# EAGLE design indication_panel (EAGLE 7.3.0)
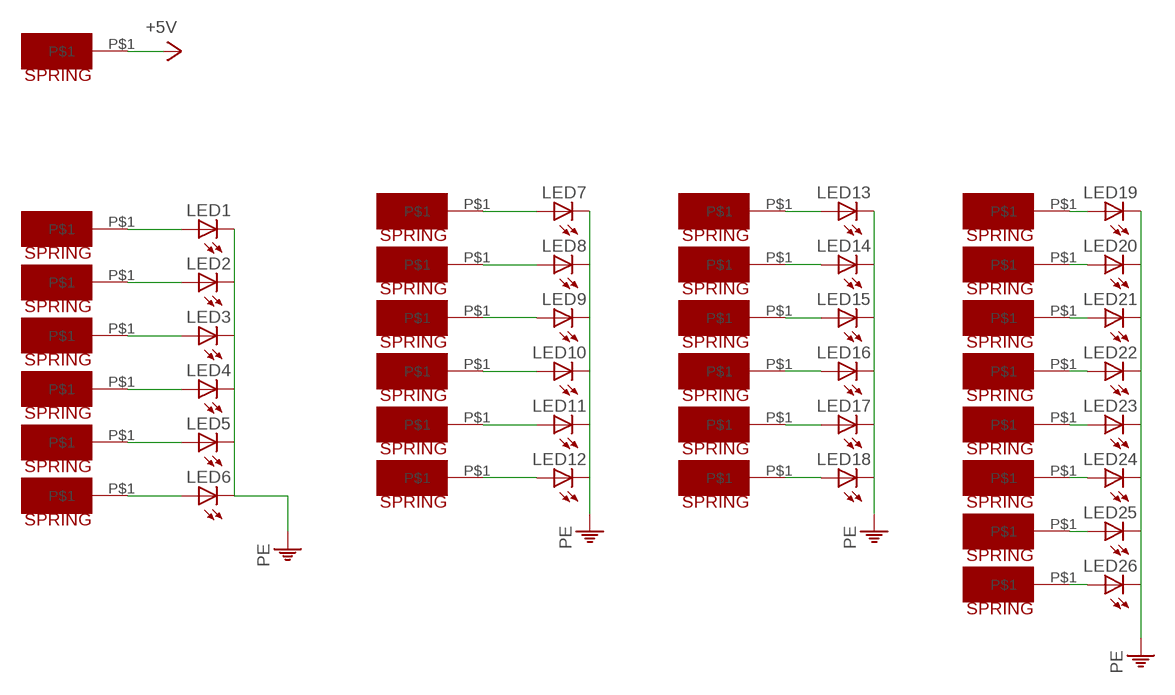
[diagram p0: schematic, sheet 1]

## Parts
+5V  SPRING  [SPRING]
LED1  LEDCHIPLED_0805  [CHIPLED_0805]
LED2  LEDCHIPLED_0805  [CHIPLED_0805]
LED3  LEDCHIPLED_0805  [CHIPLED_0805]
LED4  LEDCHIPLED_0805  [CHIPLED_0805]
LED5  LEDCHIPLED_0805  [CHIPLED_0805]
LED6  LEDCHIPLED_0805  [CHIPLED_0805]
LED7  LEDCHIPLED_0805  [CHIPLED_0805]
LED8  LEDCHIPLED_0805  [CHIPLED_0805]
LED9  LEDCHIPLED_0805  [CHIPLED_0805]
LED10  LEDCHIPLED_0805  [CHIPLED_0805]
LED11  LEDCHIPLED_0805  [CHIPLED_0805]
LED12  LEDCHIPLED_0805  [CHIPLED_0805]
LED13  LEDCHIPLED_0805  [CHIPLED_0805]
LED14  LEDCHIPLED_0805  [CHIPLED_0805]
LED15  LEDCHIPLED_0805  [CHIPLED_0805]
LED16  LEDCHIPLED_0805  [CHIPLED_0805]
LED17  LEDCHIPLED_0805  [CHIPLED_0805]
LED18  LEDCHIPLED_0805  [CHIPLED_0805]
LED19  LEDCHIPLED_0805  [CHIPLED_0805]
LED20  LEDCHIPLED_0805  [CHIPLED_0805]
LED21  LEDCHIPLED_0805  [CHIPLED_0805]
LED22  LEDCHIPLED_0805  [CHIPLED_0805]
LED23  LEDCHIPLED_0805  [CHIPLED_0805]
LED24  LEDCHIPLED_0805  [CHIPLED_0805]
LED25  LEDCHIPLED_0805  [CHIPLED_0805]
LED26  LEDCHIPLED_0805  [CHIPLED_0805]
U$1  SPRING  [SPRING]
U$2  SPRING  [SPRING]
U$3  SPRING  [SPRING]
U$4  SPRING  [SPRING]
U$6  SPRING  [SPRING]
U$7  SPRING  [SPRING]
U$8  SPRING  [SPRING]
U$9  SPRING  [SPRING]
U$10  SPRING  [SPRING]
U$11  SPRING  [SPRING]
U$12  SPRING  [SPRING]
U$13  SPRING  [SPRING]
U$14  SPRING  [SPRING]
U$15  SPRING  [SPRING]
U$16  SPRING  [SPRING]
U$17  SPRING  [SPRING]
U$18  SPRING  [SPRING]
U$19  SPRING  [SPRING]
U$20  SPRING  [SPRING]
U$21  SPRING  [SPRING]
U$22  SPRING  [SPRING]
U$23  SPRING  [SPRING]
U$24  SPRING  [SPRING]
U$25  SPRING  [SPRING]
U$26  SPRING  [SPRING]
U$27  SPRING  [SPRING]

## Nets
+5V: U$27.P$1
N$1: LED1.A U$1.P$1
N$2: LED2.A U$2.P$1
N$3: LED3.A U$3.P$1
N$4: LED4.A U$4.P$1
N$5: +5V.P$1 LED5.A
N$6: LED6.A U$6.P$1
N$7: LED7.A U$7.P$1
N$8: LED8.A U$8.P$1
N$9: LED9.A U$9.P$1
N$10: LED10.A U$10.P$1
N$11: LED11.A U$11.P$1
N$12: LED12.A U$12.P$1
N$13: LED13.A U$19.P$1
N$14: LED24.A U$18.P$1
N$15: LED14.A U$20.P$1
N$16: LED15.A U$21.P$1
N$17: LED16.A U$22.P$1
N$18: LED17.A U$23.P$1
N$19: LED18.A U$24.P$1
N$20: LED19.A U$13.P$1
N$21: LED20.A U$14.P$1
N$22: LED21.A U$15.P$1
N$23: LED22.A U$16.P$1
N$24: LED23.A U$17.P$1
N$25: LED25.A U$25.P$1
N$26: LED26.A U$26.P$1
PE: LED1.C LED2.C LED3.C LED4.C LED5.C LED6.C LED7.C LED8.C LED9.C LED10.C LED11.C LED12.C LED13.C LED14.C LED15.C LED16.C LED17.C LED18.C LED19.C LED20.C LED21.C LED22.C LED23.C LED24.C LED25.C LED26.C

## Library data of the parts
+5V U$1-U$4 U$6-U$27 = enigma:SPRING
LED1-LED26 = led:LED: LED OSRAM: - CHIPLED LG R971, LG N971, LY N971, LG Q971, LY Q971, LO R971, LY R971 LH N974, LH R974 LS Q976, LO Q976, LY Q976 LO Q996 - Hyper CHIPLED LW Q18S LB Q993, LB Q99A, LB R99A - SideLED LS A670, LO A670, LY A670, LG A670, LP A670 LB A673, LV A673, LT A673, LW A673 LH A674 LY A675 LS A676, LA A676, LO A676, LY A676, LW A676 LS A679, LY A679, LG A679 - Hyper Micro SIDELED® LS Y876, LA Y876, LO Y876, LY Y876 LT Y87S - SmartLED LW L88C, LW L88S LB L89C, LB L89S, LG L890 LS L89K, LO L89K, LY L89K LS L896, LA L896, LO L896, LY L896 - TOPLED LS T670, LO T670, LY T670, LG T670, LP T670 LSG T670, LSP T670, LSY T670, LOP T670, LYG T670 LG T671, LOG T671, LSG T671 LB T673, LV T673, LT T673, LW T673 LH T674 LS T676, LA T676, LO T676, LY T676, LB T676, LH T676, LSB T676, LW T676 LB T67C, LV T67C, LT T67C, LS T67K, LO T67K, LY T67K, LW E67C LS E67B, LA E67B, LO E67B, LY E67B, LB E67C, LV E67C, LT E67C LW T67C LS T679, LY T679, LG T679 LS T770, LO T770, LY T770, LG T770, LP T770 LB T773, LV T773, LT T773, LW T773 LH T774 LS E675, LA E675, LY E675, LS T675 LS T776, LA T776, LO T776, LY T776, LB T776 LHGB T686 LT T68C, LB T68C - Hyper Mini TOPLED® LB M676 - Mini TOPLED Santana® LG M470 LS M47K, LO M47K, LY M47K Source: http://www.osram.convergy.de LUXEON: - LUMILED® LXK2-PW12-R00, LXK2-PW12-S00, LXK2-PW14-U00, LXK2-PW14-V00 LXK2-PM12-R00, LXK2-PM12-S00, LXK2-PM14-U00 LXK2-PE12-Q00, LXK2-PE12-R00, LXK2-PE12-S00, LXK2-PE14-T00, LXK2-PE14-U00 LXK2-PB12-K00, LXK2-PB12-L00, LXK2-PB12-M00, LXK2-PB14-N00, LXK2-PB14-P00, LXK2-PB14-Q00 LXK2-PR12-L00, LXK2-PR12-M00, LXK2-PR14-Q00, LXK2-PR14-R00 LXK2-PD12-Q00, LXK2-PD12-R00, LXK2-PD12-S00 LXK2-PH12-R00, LXK2-PH12-S00 LXK2-PL12-P00, LXK2-PL12-Q00, LXK2-PL12-R00 Source: www.luxeon.com KINGBRIGHT: KA-3528ASYC Source: www.kingbright.com

## Board
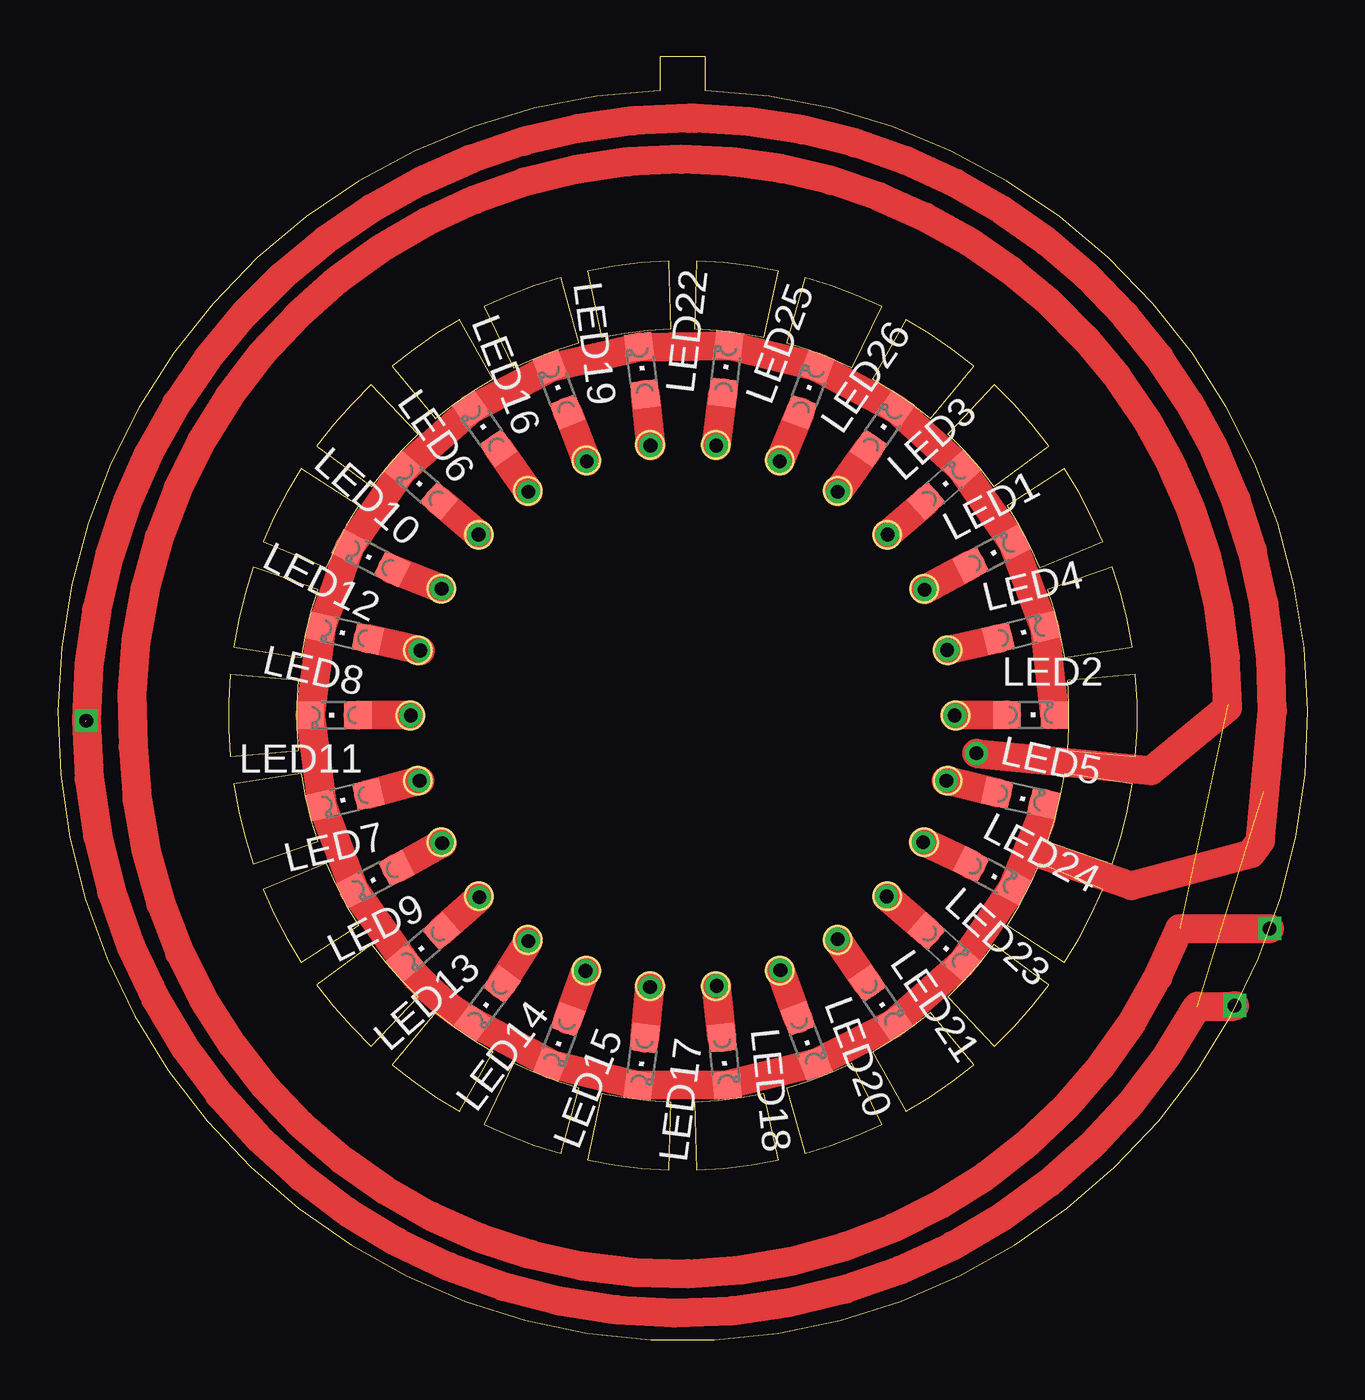
[diagram p1: board, top side]
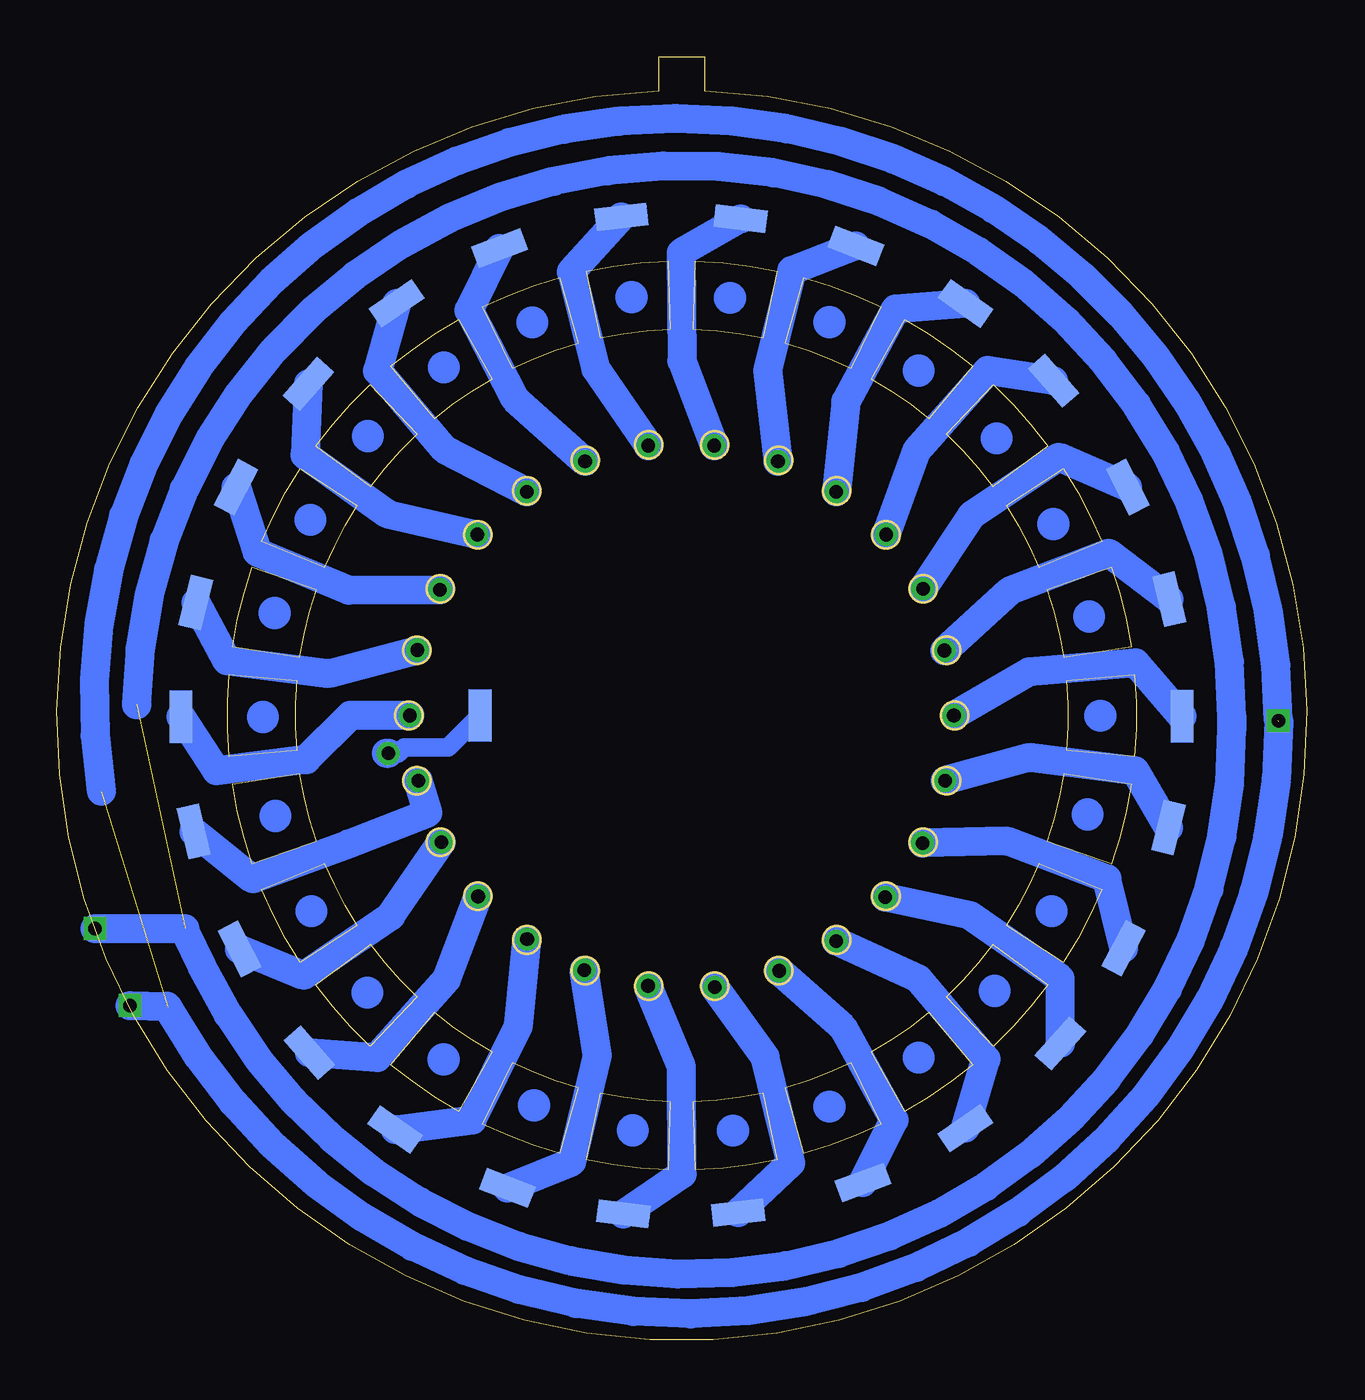
[diagram p2: board, bottom side, seen from below]

Size 55 x 56.45 mm. Coordinates in mm from the lower left corner, seen from the top.
Outline: 44.31,30.02 arc10 43.57,33.01 46.41,33.99 arc-10 47.27,30.47 44.31,30.02
Outline: 43.21,33.97 arc10 41.78,36.69 44.29,38.32 arc-10 45.98,35.12 43.21,33.97
Outline: 41.19,37.54 arc10 39.15,39.84 41.21,42.03 arc-10 43.61,39.32 41.19,37.54
Outline: 38.38,40.52 arc10 35.85,42.27 37.32,44.89 arc-10 40.3,42.83 38.38,40.52
Outline: 34.94,42.75 arc10 32.06,43.84 32.87,46.73 arc-10 36.25,45.45 34.94,42.75
Outline: 31.07,44.09 arc10 28.01,44.46 28.1,47.46 arc-10 31.7,47.02 31.07,44.09
Outline: 26.99,44.46 arc10 23.93,44.09 23.3,47.02 arc-10 26.9,47.46 26.99,44.46
Outline: 22.93,43.84 arc10 20.06,42.75 18.74,45.45 arc-10 22.13,46.73 22.93,43.84
Outline: 19.15,42.27 arc10 16.62,40.52 14.7,42.83 arc-10 17.67,44.89 19.15,42.27
Outline: 15.85,39.84 arc10 13.81,37.54 11.39,39.32 arc-10 13.79,42.03 15.85,39.84
Outline: 13.22,36.69 arc10 11.79,33.97 9.02,35.12 arc-10 10.7,38.32 13.22,36.69
Outline: 11.43,33.01 arc10 10.69,30.02 7.73,30.47 arc-10 8.59,33.99 11.43,33.01
Outline: 10.57,29 arc10 10.57,25.93 7.58,25.65 arc-10 7.58,29.27 10.57,29
Outline: 10.69,24.91 arc10 11.43,21.92 8.59,20.94 arc-10 7.73,24.46 10.69,24.91
Outline: 11.79,20.96 arc10 13.22,18.23 10.7,16.61 arc-10 9.02,19.81 11.79,20.96
Outline: 13.81,17.39 arc10 15.85,15.09 13.79,12.9 arc-10 11.39,15.61 13.81,17.39
Outline: 16.62,14.41 arc10 19.15,12.66 17.67,10.04 arc-10 14.7,12.1 16.62,14.41
Outline: 20.06,12.18 arc10 22.93,11.09 22.13,8.2 arc-10 18.74,9.48 20.06,12.18
Outline: 23.93,10.84 arc10 26.99,10.47 26.9,7.47 arc-10 23.3,7.91 23.93,10.84
Outline: 28.01,10.47 arc10 31.07,10.84 31.7,7.91 arc-10 28.1,7.47 28.01,10.47
Outline: 32.06,11.09 arc10 34.94,12.18 36.25,9.48 arc-10 32.87,8.2 32.06,11.09
Outline: 35.85,12.66 arc10 38.38,14.41 40.3,12.1 arc-10 37.32,10.04 35.85,12.66
Outline: 39.15,15.09 arc10 41.19,17.39 43.61,15.61 arc-10 41.21,12.9 39.15,15.09
Outline: 41.78,18.23 arc10 43.21,20.96 45.98,19.81 arc-10 44.29,16.61 41.78,18.23
Outline: 43.57,21.92 arc10 44.31,24.91 47.27,24.46 arc-10 46.41,20.94 43.57,21.92
Outline: 44.43,25.93 arc10 44.43,29 47.42,29.27 arc-10 47.42,25.65 44.43,25.93
Outline: 26.5,54.95 arc356 28.5,54.95 28.5,56.45 26.5,56.45 26.5,54.95
Outline: circle at 38.12,33.04 radius 0.6
Outline: circle at 34.32,37.34 radius 0.6
Outline: circle at 28.95,39.38 radius 0.6
Outline: circle at 23.24,38.68 radius 0.6
Outline: circle at 18.52,35.42 radius 0.6
Outline: circle at 15.85,30.34 radius 0.6
Outline: circle at 15.85,24.59 radius 0.6
Outline: circle at 18.52,19.51 radius 0.6
Outline: circle at 23.24,16.24 radius 0.6
Outline: circle at 28.95,15.55 radius 0.6
Outline: circle at 34.32,17.59 radius 0.6
Outline: circle at 38.12,21.89 radius 0.6
Outline: circle at 39.5,27.46 radius 0.6
Outline: circle at 39.15,24.59 radius 0.6
Outline: circle at 36.48,19.51 radius 0.6
Outline: circle at 31.75,16.24 radius 0.6
Outline: circle at 26.05,15.55 radius 0.6
Outline: circle at 20.68,17.59 radius 0.6
Outline: circle at 16.87,21.89 radius 0.6
Outline: circle at 15.5,27.46 radius 0.6
Copper layers (1*16): Top 0.035mm / dielectric 1.5mm / Bottom 0.035mm
Design rules "default": minimum track width 10mil, minimum drill 24mil, track to track 8mil, track to pad 8mil, pad to pad 8mil, via to via 8mil, smd to smd 8mil, copper to edge 40mil, drill to drill 8mil, minimum pad ring 10mil, minimum via ring 8mil, stop-mask expansion 4mil, vias tented up to drill 0mil, thermal gap 10mil

### Footprints (pad centres in the part's own frame; a part is rotated, then mirrored left to right if it is on the bottom)
SPRING = smd 2.3 x 1: P$1 0,0
CHIPLED_0805 = smd 1.2 x 1.2: A 0,-1.05; C 0,1.05

### Placement (x,y rotation side)
+5V  48.97,22.36 283.2 bottom
LED1  41.09,34.58 297.8 top
LED2  42.8,27.49 270 top
LED3  38.99,37.6 311.7 top
LED4  42.4,31.1 283.9 top
LED5  42.36,23.83 257.5 top
LED6  18.77,40.09 35.1 top
LED7  12.64,23.76 103.2 top
LED8  12.61,31.08 76.8 top
LED9  13.96,20.26 117.1 top
LED10  15.98,37.6 49 top
LED11  12.14,27.48 90 top
LED12  13.77,34.39 62.9 top
LED13  16.07,17.28 131 top
LED14  18.9,14.8 143.1 top
LED15  22.06,13.11 158.8 top
LED16  22.04,41.8 21.2 top
LED17  25.7,12.24 172.7 top
LED18  29.33,12.25 185.9 top
LED19  25.71,42.64 7.3 top
LED20  32.93,13.15 200.5 top
LED21  36.21,14.82 214.4 top
LED22  29.39,42.7 353.4 top
LED23  39.01,17.28 228.3 top
LED24  41.11,20.42 242.2 top
LED25  33.02,41.8 339.5 top
LED26  36.27,40.09 325.6 top
U$1  47.11,37.51 62.2 bottom
U$2  49.53,27.41 90 bottom
U$3  43.93,42.06 228.3 bottom
U$4  48.89,32.43 76.1 bottom
U$6  15.02,45.59 324.9 bottom
U$7  6.09,22.54 76.1 bottom
U$8  6.05,32.58 283.2 bottom
U$9  8.06,17.23 62.2 bottom
U$10  11.14,42.2 311 bottom
U$11  5.49,27.43 90 bottom
U$12  7.88,37.51 297.1 bottom
U$13  24.91,49.32 172.7 bottom
U$14  35.17,6.67 338.8 bottom
U$15  40.11,9.24 324.9 bottom
U$16  30.15,49.41 6.6 bottom
U$17  43.88,12.63 311 bottom
U$18  46.96,17.19 297.1 bottom
U$19  10.84,13.04 48.3 bottom
U$20  15.03,9.3 34.4 bottom
U$21  19.54,6.92 20.5 bottom
U$22  19.84,48.13 338.8 bottom
U$23  25.01,5.59 6.6 bottom
U$24  30.06,5.53 352.7 bottom
U$25  35.53,48.03 20.5 bottom
U$26  40.05,45.6 34.4 bottom
U$27  36.38,27.46 90 bottom

### Tracks (layer width: path | path; a pad name or v marks a point on that pad's centre or on a via)
+5V  (via drill 0.6)  (1 unrouted)
  Top 1.27: v40.42,25.8 48.11,25.04 51.48,27.81 arc90 27.42,51.94 arc94 3.31,26.09 arc157 49.36,18.09 v53.32,18.09
  Bottom 0.813: U$27.P$1 37.77,26.07 39.72,26.07 39.98,25.8 v40.42,25.8
  Bottom 1.27: 40.49,25.8 v40.42,25.8 | v53.32,18.09 49.37,18.09 49.37,17.99 48.61,16.4 arc-155 3.29,26.88 arc1 3.29,27.39 arc-179 51.5,27.97 arc-92 51.48,27.95
N$1  (via drill 0.6)
  Top 1.27: LED1.A v38.14,33
  Bottom 1.27: U$1.P$1 46.19,34.67 42.14,32.98 v38.14,33
N$2  (via drill 0.6)
  Top 1.27: LED2.A v39.46,27.46
  Bottom 1.27: v39.46,27.46 42.08,27.46 44.02,25.52 47.97,25.03 U$2.P$1
N$3  (via drill 0.6)
  Top 1.27: v36.5,35.43 LED3.A
  Bottom 1.27: U$3.P$1 44.07,38.93 40.44,36.33 v36.5,35.43
N$4  (via drill 0.6)
  Top 1.27: v39.13,30.35 LED4.A
  Bottom 1.27: U$4.P$1 47.51,29.88 43.02,29.32 v39.13,30.35
N$5  (via drill 0.6)
  Top 1.27: LED5.A v39.09,24.59
  Bottom 1.27: +5V.P$1 46.37,20.28 42.16,21.81 38.66,23.18 v39.09,24.59
N$6  (via drill 0.6)
  Top 1.27: LED6.A v20.7,37.31
  Bottom 1.27: U$6.P$1 18.09,45.35 20.29,41.28 v20.7,37.31
N$7  (via drill 0.6)
  Top 1.27: v15.92,24.59 LED7.A
  Bottom 1.27: U$7.P$1 7.55,25.03 12.23,25.61 v15.92,24.59
N$8  (via drill 0.6)
  Top 1.27: v15.94,30.32 LED8.A
  Bottom 1.27: U$8.P$1 8.72,34.6 13.08,32.94 v15.94,30.32
N$9  (via drill 0.6)
  Top 1.27: LED9.A v16.91,21.85
  Bottom 1.27: U$9.P$1 8.79,20.28 13.2,21.94 v16.91,21.85
N$10  (via drill 0.6)
  Top 1.27: v18.51,35.43 LED10.A
  Bottom 1.27: U$10.P$1 14.05,42.64 17.17,39.11 v18.51,35.43
N$11  (via drill 0.6)
  Top 1.27: v15.52,27.46 LED11.A
  Bottom 1.27: U$11.P$1 7.52,29.78 12.22,29.38 v15.52,27.46
N$12  (via drill 0.6)
  Top 1.27: LED12.A v16.88,33.04
  Bottom 1.27: U$12.P$1 10.91,38.83 14.75,36.27 v16.88,33.04
N$13  (via drill 0.6)
  Top 1.27: v18.55,19.46 LED13.A
  Bottom 1.27: U$19.P$1 10.85,15.9 14.81,18.66 v18.55,19.46
N$14  (via drill 0.6)
  Top 1.27: LED24.A v38.08,21.89
  Bottom 1.27: U$18.P$1 44.14,16.03 40.3,18.64 v38.08,21.89
N$15  (via drill 0.6)
  Top 1.27: LED14.A v20.7,17.53
  Bottom 1.27: U$20.P$1 14.11,12.35 17.09,15.87 v20.7,17.53
N$16  (via drill 0.6)
  Top 1.27: LED15.A v23.22,16.23
  Bottom 1.27: U$21.P$1 18.16,9.66 20.41,13.74 v23.22,16.23
N$17  (via drill 0.6)
  Top 1.27: LED16.A v23.27,38.64
  Bottom 1.27: U$22.P$1 22.66,47.05 23.73,42.65 v23.27,38.64
N$18  (via drill 0.6)
  Top 1.27: LED17.A v26.05,15.51
  Bottom 1.27: U$23.P$1 22.7,7.78 23.83,12.44 v26.05,15.51
N$19  (via drill 0.6)
  Top 1.27: LED18.A v28.99,15.56
  Bottom 1.27: U$24.P$1 27.49,7.3 27.51,12.02 v28.99,15.56
N$20  (via drill 0.6)
  Top 1.27: LED19.A v26.08,39.34
  Bottom 1.27: U$13.P$1 27.52,47.82 27.5,43.06 v26.08,39.34
N$21  (via drill 0.6)
  Top 1.27: LED20.A v31.79,16.26
  Bottom 1.27: U$14.P$1 32.34,7.83 31.21,12.49 v31.79,16.26
N$22  (via drill 0.6)
  Top 1.27: LED21.A v34.31,17.62
  Bottom 1.27: U$15.P$1 36.72,9.67 34.69,13.8 v34.31,17.62
N$23  (via drill 0.6)
  Top 1.27: v28.97,39.34 LED22.A
  Bottom 1.27: U$16.P$1 32.35,46.98 31.28,42.72 v28.97,39.34
N$24  (via drill 0.6)
  Top 1.27: LED23.A v36.47,19.5
  Bottom 1.27: U$17.P$1 40.9,12.42 37.85,15.84 v36.47,19.5
N$25  (via drill 0.6)
  Top 1.27: LED25.A v31.75,38.64
  Bottom 1.27: U$25.P$1 36.86,45.3 34.85,41.41 v31.75,38.64
N$26  (via drill 0.6)
  Top 1.27: LED26.A v34.32,37.31
  Bottom 1.27: U$26.P$1 40.89,42.63 37.95,39.19 v34.32,37.31
PE  (via drill 0.6)  (2 unrouted)
  Top 1.27: LED2.C LED4.C LED1.C LED3.C LED26.C LED25.C LED22.C LED19.C LED16.C LED6.C LED10.C LED12.C LED8.C LED11.C LED7.C LED9.C LED13.C arc23 LED14.C LED15.C LED17.C LED18.C LED20.C LED21.C LED23.C LED24.C 43.25,22.9 | 43.25,22.9 LED5.C | 43.25,22.9 42.69,21.55 47.24,19.98 52.51,21.39 52.91,21.95 53.45,27.64 arc90 28.03,53.74 27.75,53.74 arc90 v1.25,27.24 arc151 50.14,14.68 51.76,14.68 v51.78,14.7
  Bottom 1.27: v51.78,14.7 50.16,14.68 48.78,12.45 | 1.22,27.2 arc151 50.12,14.64 | v1.25,27.24 arc-90 27.74,53.73 27.82,53.73 arc-99 53.04,24.12
(copper drawn outside any net)
  shapes: Bottom circle x26